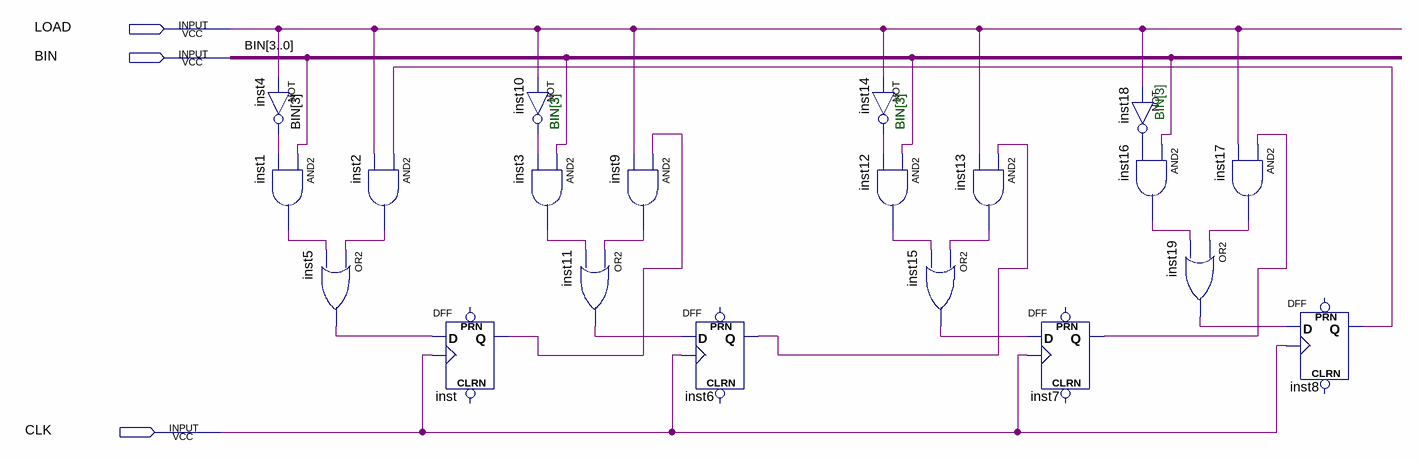
[diagram p0: schematic sheet]
// Quartus schematic shiftregB.bdf as structural Verilog: 20 symbols, 3 pins
module shiftregB (
  input  LOAD,
  input  BIN,
  input  CLK
);

  wire inst1_out, inst2_out, inst3_out, inst4_out, inst5_out, inst6_q, inst7_q, inst8_q, inst9_out,
       inst10_out, inst11_out, inst12_out, inst13_out, inst14_out, inst15_out, inst16_out, inst17_out,
       inst18_out, inst19_out, inst_q, undriven;
  wire [3:3] BIN_bus;

  not inst4 (inst4_out, LOAD);
  and inst1 (inst1_out, BIN_bus[3], inst4_out);
  or inst5 (inst5_out, inst2_out, inst1_out);
  and inst2 (inst2_out, inst8_q, LOAD);
  DFF inst (.CLK(CLK), .D(inst5_out), .Q(inst_q));  // open: CLRN, PRN
  not inst10 (inst10_out, LOAD);
  and inst3 (inst3_out, BIN_bus[3], inst10_out);
  and inst9 (inst9_out, inst_q, LOAD);
  or inst11 (inst11_out, inst9_out, inst3_out);
  DFF inst6 (.CLK(CLK), .D(inst11_out), .Q(inst6_q));  // open: CLRN, PRN
  not inst14 (inst14_out, LOAD);
  and inst12 (inst12_out, BIN_bus[3], inst14_out);
  or inst15 (inst15_out, inst13_out, inst12_out);
  and inst13 (inst13_out, inst6_q, LOAD);
  DFF inst7 (.CLK(CLK), .D(inst15_out), .Q(inst7_q));  // open: CLRN, PRN
  not inst18 (inst18_out, LOAD);
  and inst16 (inst16_out, undriven, inst18_out);
  and inst17 (inst17_out, inst7_q, LOAD);
  or inst19 (inst19_out, inst17_out, inst16_out);
  DFF inst8 (.CLK(CLK), .D(inst19_out), .Q(inst8_q));  // open: CLRN, PRN

  // Notes on the sheet:
  //   BIN[3]
  //   BIN[3]
  //   BIN[3]
endmodule
